# Altium schematic sheet pedal_hard_clipping.SchDoc
size A4
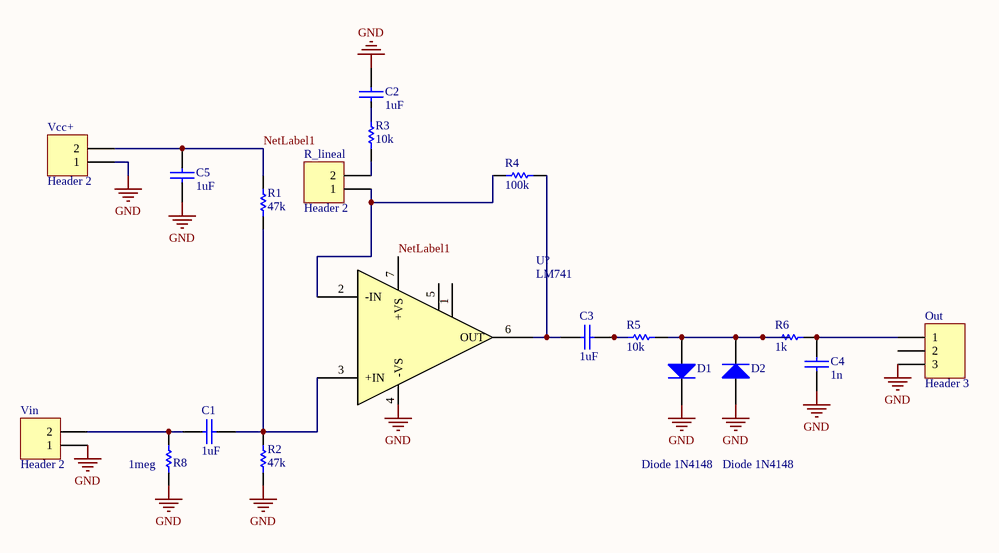
[diagram p0: pedal_hard_clipping.SchDoc]

## Parts
1meg  R8  [RES400]
C1  1uF  [CAP200]
C2  1uF  [CAP200]
C3  1uF  [CAP200]
C4  1n  [CAP200]
C5  1uF  [CAP200]
D1  Diode 1N4148  [DO-35]
D2  Diode 1N4148  [DO-35]
Out  Header 3  [HDR1X3]
R1  47k  [RES400]
R2  47k  [RES400]
R3  10k  [RES400]
R4  100k  [RES400]
R5  10k  [RES400]
R6  1k  [RES400]
R_lineal  Header 2  [HDR1X2]
U?  LM741  [DIP8]
Vcc+  Header 2  [HDR1X2]
Vin  Header 2  [HDR1X2]

## Nets
GND: 1meg.1 C2.1 C4.1 C5.2 D1.2(K) D2.1(A) Out.3 R2.1 U?.4(-VS) Vcc+.1 Vin.1
NetLabel1: C5.1 R1.2 U?.7(+VS) Vcc+.2
Net1meg_2: 1meg.2 C1.2 Vin.2
NetC1_1: C1.1 R1.1 R2.2 U?.3(+IN)
NetC2_2: C2.2 R3.2
NetC3_1: C3.1 R4.2 U?.6(OUT)
NetC3_2: C3.2 R5.1
NetC4_2: C4.2 Out.1 R6.2
NetD1_1: D1.1(A) D2.2(K) R5.2 R6.1
NetR3_1: R3.1 R_lineal.2
NetR4_1: R4.1 R_lineal.1 U?.2(-IN)

Not connected (* = marked no-connect by the designer): Out 2; U? 1(-RG) 5(+RG)

## Library data of the parts
1meg R1-R6 = RES
C1-C5 = CAP
D1 D2 = Diode 1N4148: High Conductance Fast Diode; Published: 8-Jun-2000; LatestRevisionDate: 17-Jul-2002; LatestRevisionNote: Re-released for DXP Platform.; DatasheetVersion: 1997; PackageReference: DO-35; Publisher: Altium Limited; PackageDescription: Diode, Axial; Body 3.8 x 1.9 mm (LxDia. max), Lead Dia. 0.53 mm (max); Code_JEDEC: DO-204-AH; ComponentLink1Description: Manufacturer Link; ComponentLink1URL: http://www.fairchildsemi.com/; ComponentLink2Description: Datasheet; ComponentLink2URL: http://www.fairchildsemi.com/ds/1N%2F1N4148.pdf
Out = Header 3: Header, 3-Pin; LatestRevisionDate: 17-Jul-2002; LatestRevisionNote: Re-released for DXP Platform.; Publisher: Altium Limited
R_lineal Vcc+ Vin = Header 2: Header, 2-Pin; LatestRevisionDate: 17-Jul-2002; LatestRevisionNote: Re-released for DXP Platform.; Publisher: Altium Limited
U? = LM741: LM741 Operational Amplifier